# EasyEDA Pro project decimal-up-counter-d-flipflop.epro

# Schematic Schematic1
Board Name: Board1; Create Date: 2025-10-23; Page Name: P1; Project Name: sasindu; Schematic Name: Schematic1; Update Date: 2025-10-23; Company: EasyEDA.com; Page Size: A4; Version: V1.0
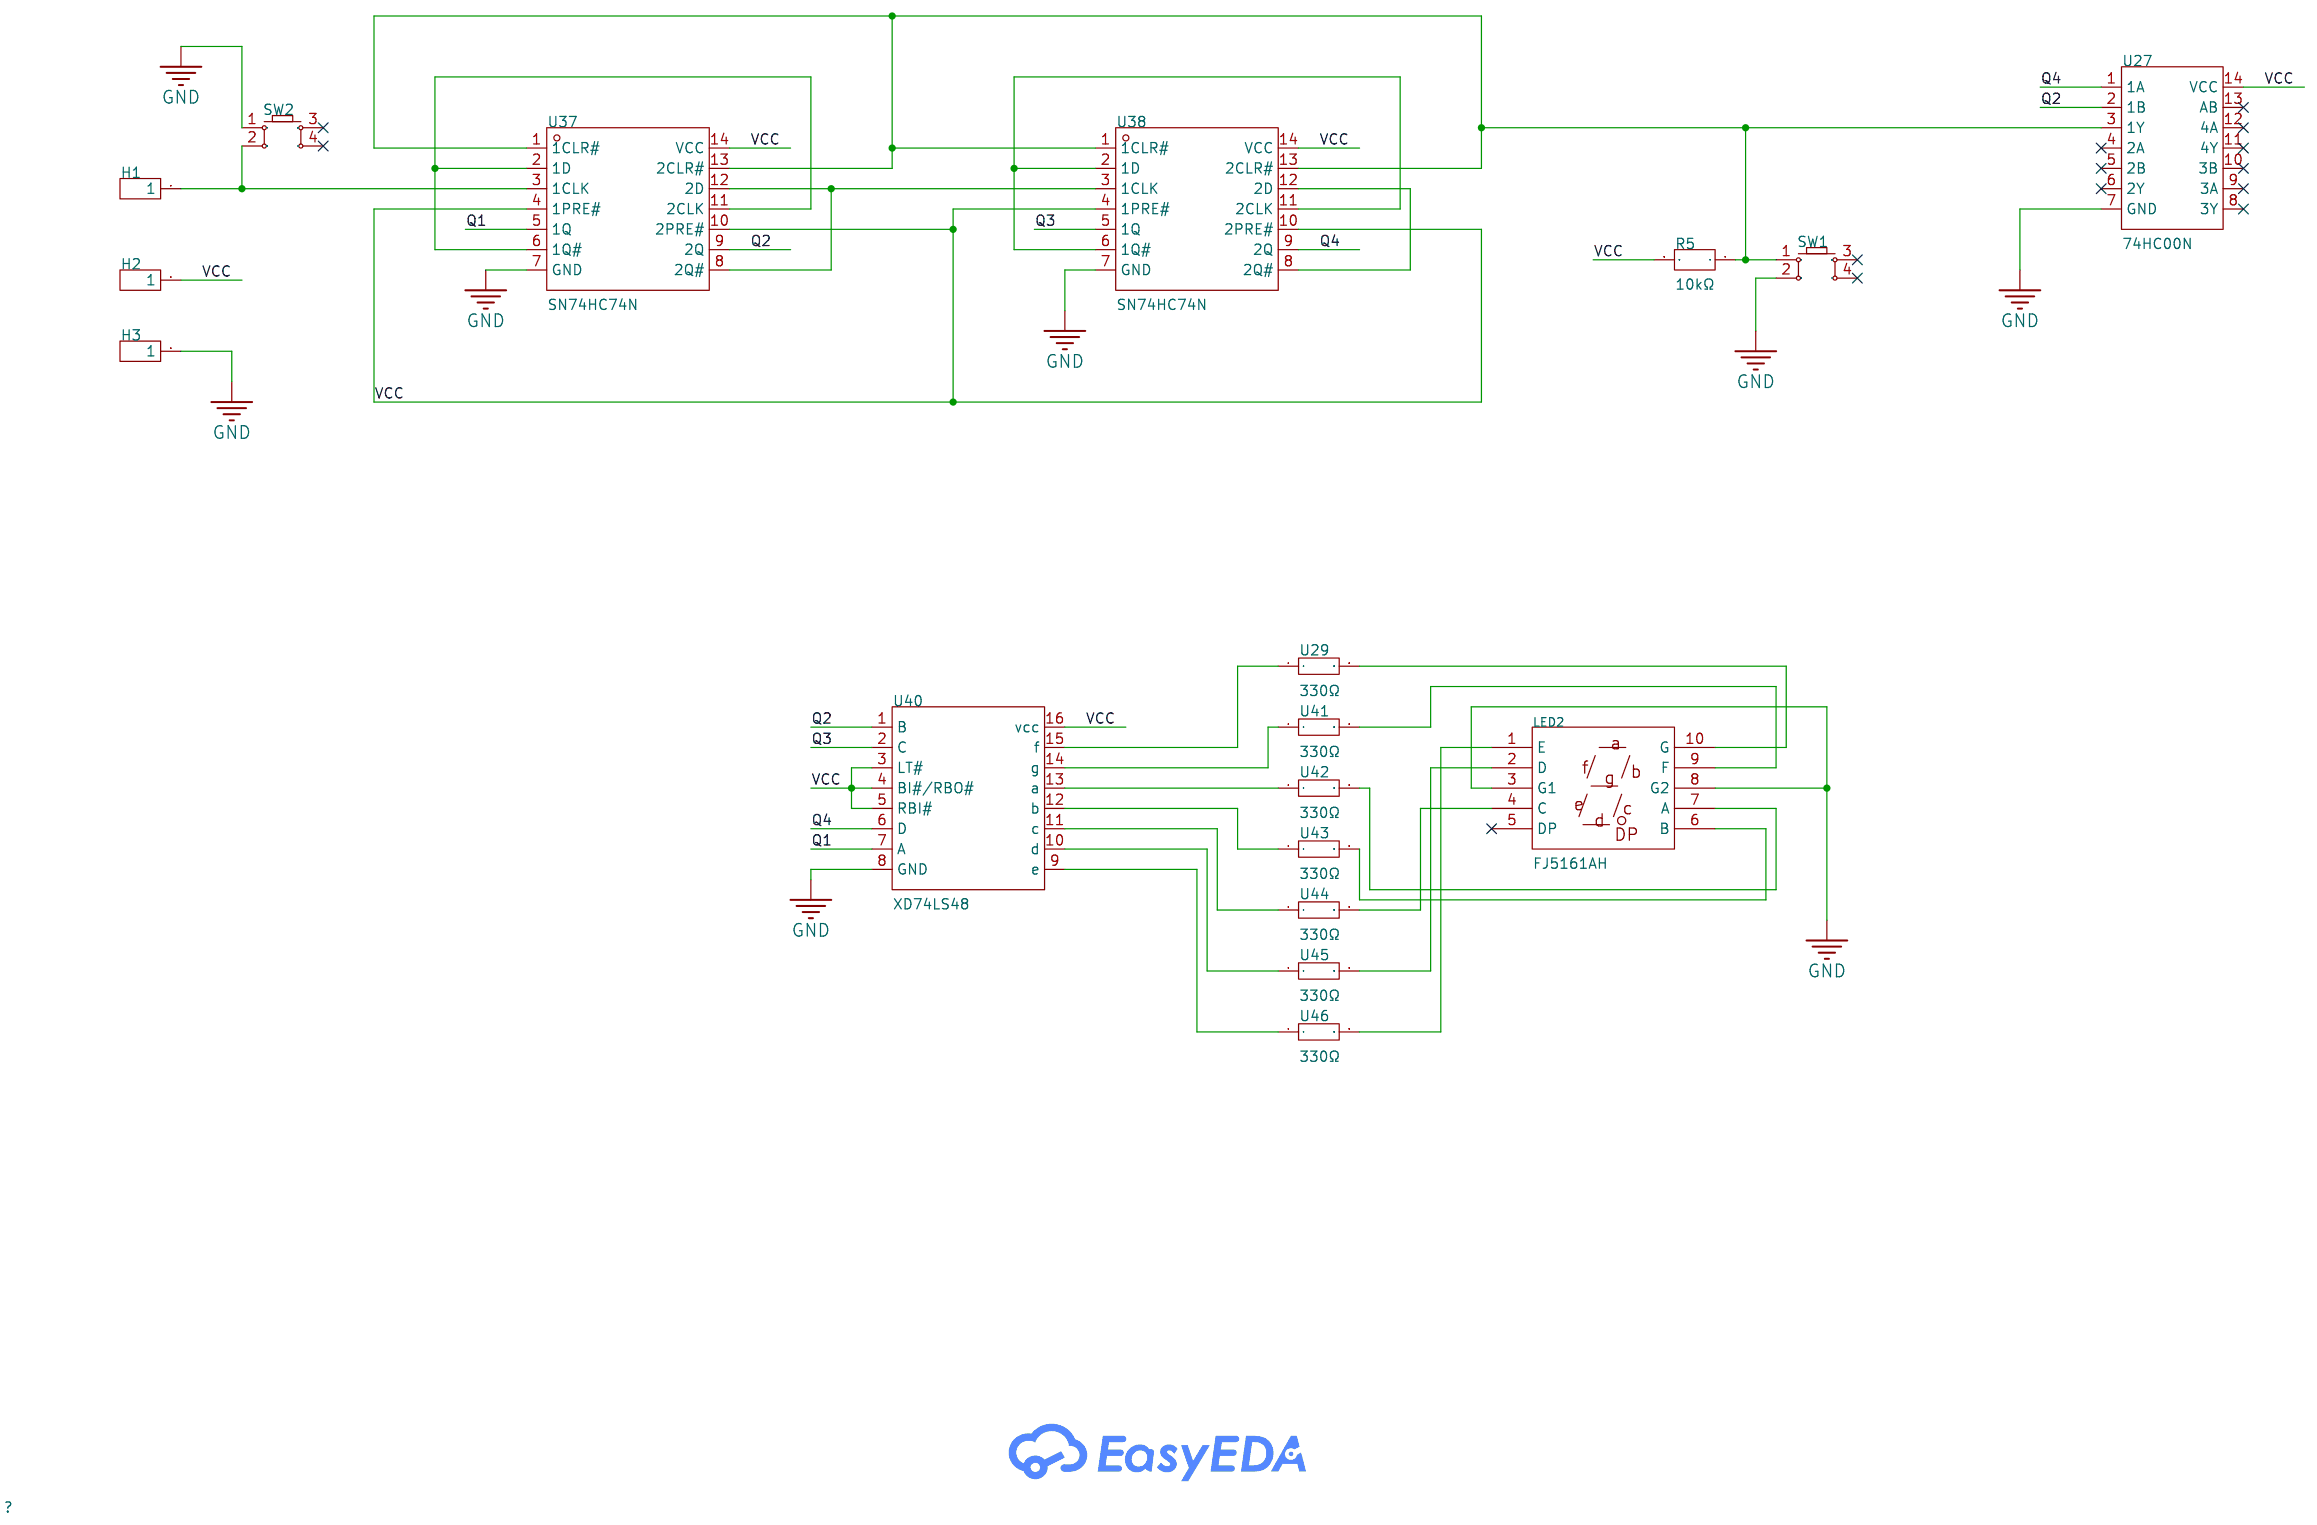
[diagram p0: schematic sheet]

## Parts
H1  -  [HDR-TH_1P-V-M_XKB_X4611WV-01I-C28D40]
H2  -  [HDR-TH_1P-V-M_XKB_X4611WV-01I-C28D40]
H3  -  [HDR-TH_1P-V-M_XKB_X4611WV-01I-C28D40]
LED2  FJ5161AH  [LED-SEG-TH_10P-L12.6-W19.0-P2.54-S15.24-BL]
R5  10kΩ  [RES-TH_BD2.5-L6.5-P10.50-D0.6]
SW1  -  [KEY-TH_4P-L6.0-W6.0-P3.90-LS6.5]
SW2  -  [KEY-TH_4P-L6.0-W6.0-P3.90-LS6.5]
U27  74HC00N  [DIP-14_L19.0-W7.0-P2.54-LS7.6-BL]
U29  330Ω  [RES-TH_BD2.3-L7.1-P11.10-D0.6]
U37  SN74HC74N  [PDIP-14_L19.3-W6.4-P2.54-LS7.6-BL]
U38  SN74HC74N  [PDIP-14_L19.3-W6.4-P2.54-LS7.6-BL]
U40  XD74LS48  [DIP-16_L19.3-W6.4-P2.54-LS7.6-BL]
U41  330Ω  [RES-TH_BD2.3-L7.1-P11.10-D0.6]
U42  330Ω  [RES-TH_BD2.3-L7.1-P11.10-D0.6]
U43  330Ω  [RES-TH_BD2.3-L7.1-P11.10-D0.6]
U44  330Ω  [RES-TH_BD2.3-L7.1-P11.10-D0.6]
U45  330Ω  [RES-TH_BD2.3-L7.1-P11.10-D0.6]
U46  330Ω  [RES-TH_BD2.3-L7.1-P11.10-D0.6]

## Library data of the parts
H1-H3 = HDR-M_2.54_1x1P: Supplier Footprint: Through
LED2 = FJ5161AH: Number of Characters:1 Display Type:- Digit/Alpha Size(inch):0.56 Pd - Power Dissipation:- Illumination Color:Red LED Polarity:Common Cathode; LCSC Part Name: 1位0.56英寸红色数码管 共阴极; Supplier Part: C8093; Manufacturer: 志浩; Supplier Footprint: 插件; JLCPCB Part Class: Extended Part; Datasheet: https://item.szlcsc.com/datasheet/FJ5161AH/8576.html; Supplier: LCSC; Number of Characters: 1; Digit/Alpha Size(inch): 0.56; Illumination Color: Red; LED Polarity: Common Cathode
R5 = MBB02070C1002FCT00: Type:Metal Film Resistors Resistance: Tolerance:±1% Tolerance:±1% Power(Watts):600mW Temperature Coefficient:±50ppm/℃ Temperature Coefficient:±50ppm/℃ Operating Temperature Range:-55℃~+155℃ Operating Temperature Range:-55℃~+155℃; LCSC Part Name: 金属膜电阻 10kΩ ±1% 600mW; Supplier Part: C1364513; Manufacturer: VISHAY(威世); Supplier Footprint: 插件,D2.5xL6.5mm; JLCPCB Part Class: Extended Part; Datasheet: https://atta.szlcsc.com/upload/public/pdf/source/20210430/B7BC0816ABBF03221EE8A99AEEE87AD9.pdf; Supplier: LCSC; Type: Metal Film Resistors; Tolerance: ±1%; Power(Watts): 600mW; Temperature Coefficient: ±50ppm/℃; Operating Temperature Range: -55℃~+155℃
SW1 SW2 = Key_TH_6x6x4.5: Supplier Footprint: Through
U27 = 74HC00N: LCSC Part Name: 停产 74HC00N; Supplier Part: C596352; Manufacturer: HTC; Supplier Footprint: DIP-14; JLCPCB Part Class: Extended Part; Datasheet: https://atta.szlcsc.com/upload/public/pdf/source/20200608/C596352_1E871BDE7F9BA39D848707B6FAD9AD4E.pdf; Supplier: LCSC
U29 U41-U46 = RF25CT52A331J: Type:Fuse Resistor Resistance:330Ω Tolerance:±5% Tolerance:±5% Voltage-Supply(Max):- Operating Temperature:-45℃~+155℃ Operating Temperature:-45℃~+155℃; LCSC Part Name: 保险电阻 330Ω ±5%; Supplier Part: C367444; Manufacturer: KOA; Supplier Footprint: 插件,D2.3xL6.3mm; JLCPCB Part Class: Extended Part; Datasheet: https://atta.szlcsc.com/upload/public/pdf/source/20190124/C367444_F609FD77DA443C76335275F008267365.pdf; Supplier: LCSC; Type: Fuse Resistor; Tolerance: ±5%; Operating Temperature: -45℃~+155℃
U37 U38 = SN74HC74N: Type:D-Type Trigger Type:Rising Edge Voltage - Supply:2V~6V Voltage - Supply:2V~6V Clock Frequency:60MHz Function:Set and Reset Number of Elements:2 Number of Bits per Element:1 Output Type:Complementary Type Propagation Delay:30ns@6V,50pF Series:74HCSeri; Supplier Part: C2895; Manufacturer: TI(德州仪器); Supplier Footprint: DIP-14; JLCPCB Part Class: Extended Part; Datasheet: https://www.ti.com/cn/lit/gpn/sn74hc74; Supplier: LCSC; Type: D-Type; Trigger Type: Rising Edge; Voltage - Supply: 2V~6V; Clock Frequency: 60MHz; Function: Set and Reset; Number of Elements: 2; Number of Bits per Element: 1; Output Type: Complementary Type; Propagation Delay: 30ns@6V,50pF; Series: 74HCSeries; Current - Output Low(IOL): 5.2mA; Current - Output High(IOH): 5.2mA; Quiescent Current: 4uA; Input Capacitance: 3pF; Operating Temperature: -40℃~+85℃
U40 = XD74LS48: Voltage - Supply:4.75V~5.25V Voltage - Supply:4.75V~5.25V Features:Common Cathode Operating Temperature:0℃~+70℃ Operating Temperature:0℃~+70℃; Supplier Part: C609759; Manufacturer: XINLUDA(信路达); Supplier Footprint: DIP-16; JLCPCB Part Class: Extended Part; Datasheet: https://item.szlcsc.com/datasheet/XD74LS48/639764.html; Supplier: LCSC; Voltage - Supply: 4.75V~5.25V; Features: Common Cathode; Operating Temperature: 0℃~+70℃

## Nets
GND: H3.1 LED2.3(G1) LED2.8(G2) SW1.2 SW2.1 U27.7(GND) U37.7(GND) U38.7(GND) U40.8(GND)
VCC: H2.1 R5.2 U27.14(VCC) U37.4(1PRE#) U37.10(2PRE#) U37.14(VCC) U38.4(1PRE#) U38.10(2PRE#) U38.14(VCC) U40.3(LT#) U40.4(BI#/RBO#) U40.5(RBI#) U40.16(vcc)
Q1: U37.5(1Q) U40.7(A)
Q2: U27.2(1B) U37.9(2Q) U40.1(B)
Q3: U38.5(1Q) U40.2(C)
Q4: U27.1(1A) U38.9(2Q) U40.6(D)
$1N245: U38.8(2Q#) U38.12(2D)
$1N262: R5.1 SW1.1 U27.3(1Y) U37.1(1CLR#) U37.13(2CLR#) U38.1(1CLR#) U38.13(2CLR#)
$1N264: U38.2(1D) U38.6(1Q#) U38.11(2CLK)
$1N265: U37.2(1D) U37.6(1Q#) U37.11(2CLK)
$1N266: H1.1 SW2.2 U37.3(1CLK)
$1N268: U37.8(2Q#) U37.12(2D) U38.3(1CLK)
$1N1971: U40.9(e) U46.1
$1N1977: LED2.1(E) U46.2
$1N1984: U40.10(d) U45.1
$1N1990: LED2.2(D) U45.2
$1N2000: U40.11(c) U44.1
$1N2007: LED2.4(C) U44.2
$1N2014: U40.12(b) U43.1
$1N2024: LED2.6(B) U43.2
$1N2040: LED2.7(A) U42.2
$1N2083: LED2.9(F) U41.2
$1N2091: LED2.10(G) U29.2
$1N2112: U29.1 U40.15(f)
$1N2137: U40.14(g) U41.1
$1N2140: U40.13(a) U42.1

Not connected (* = marked no-connect by the designer): LED2 5(DP)*; SW1 3* 4*; SW2 3* 4*; U27 4(2A)* 5(2B)* 6(2Y)* 8(3Y)* 9(3A)* 10(3B)* 11(4Y)* 12(4A)* 13(AB)*

# Board PCB1
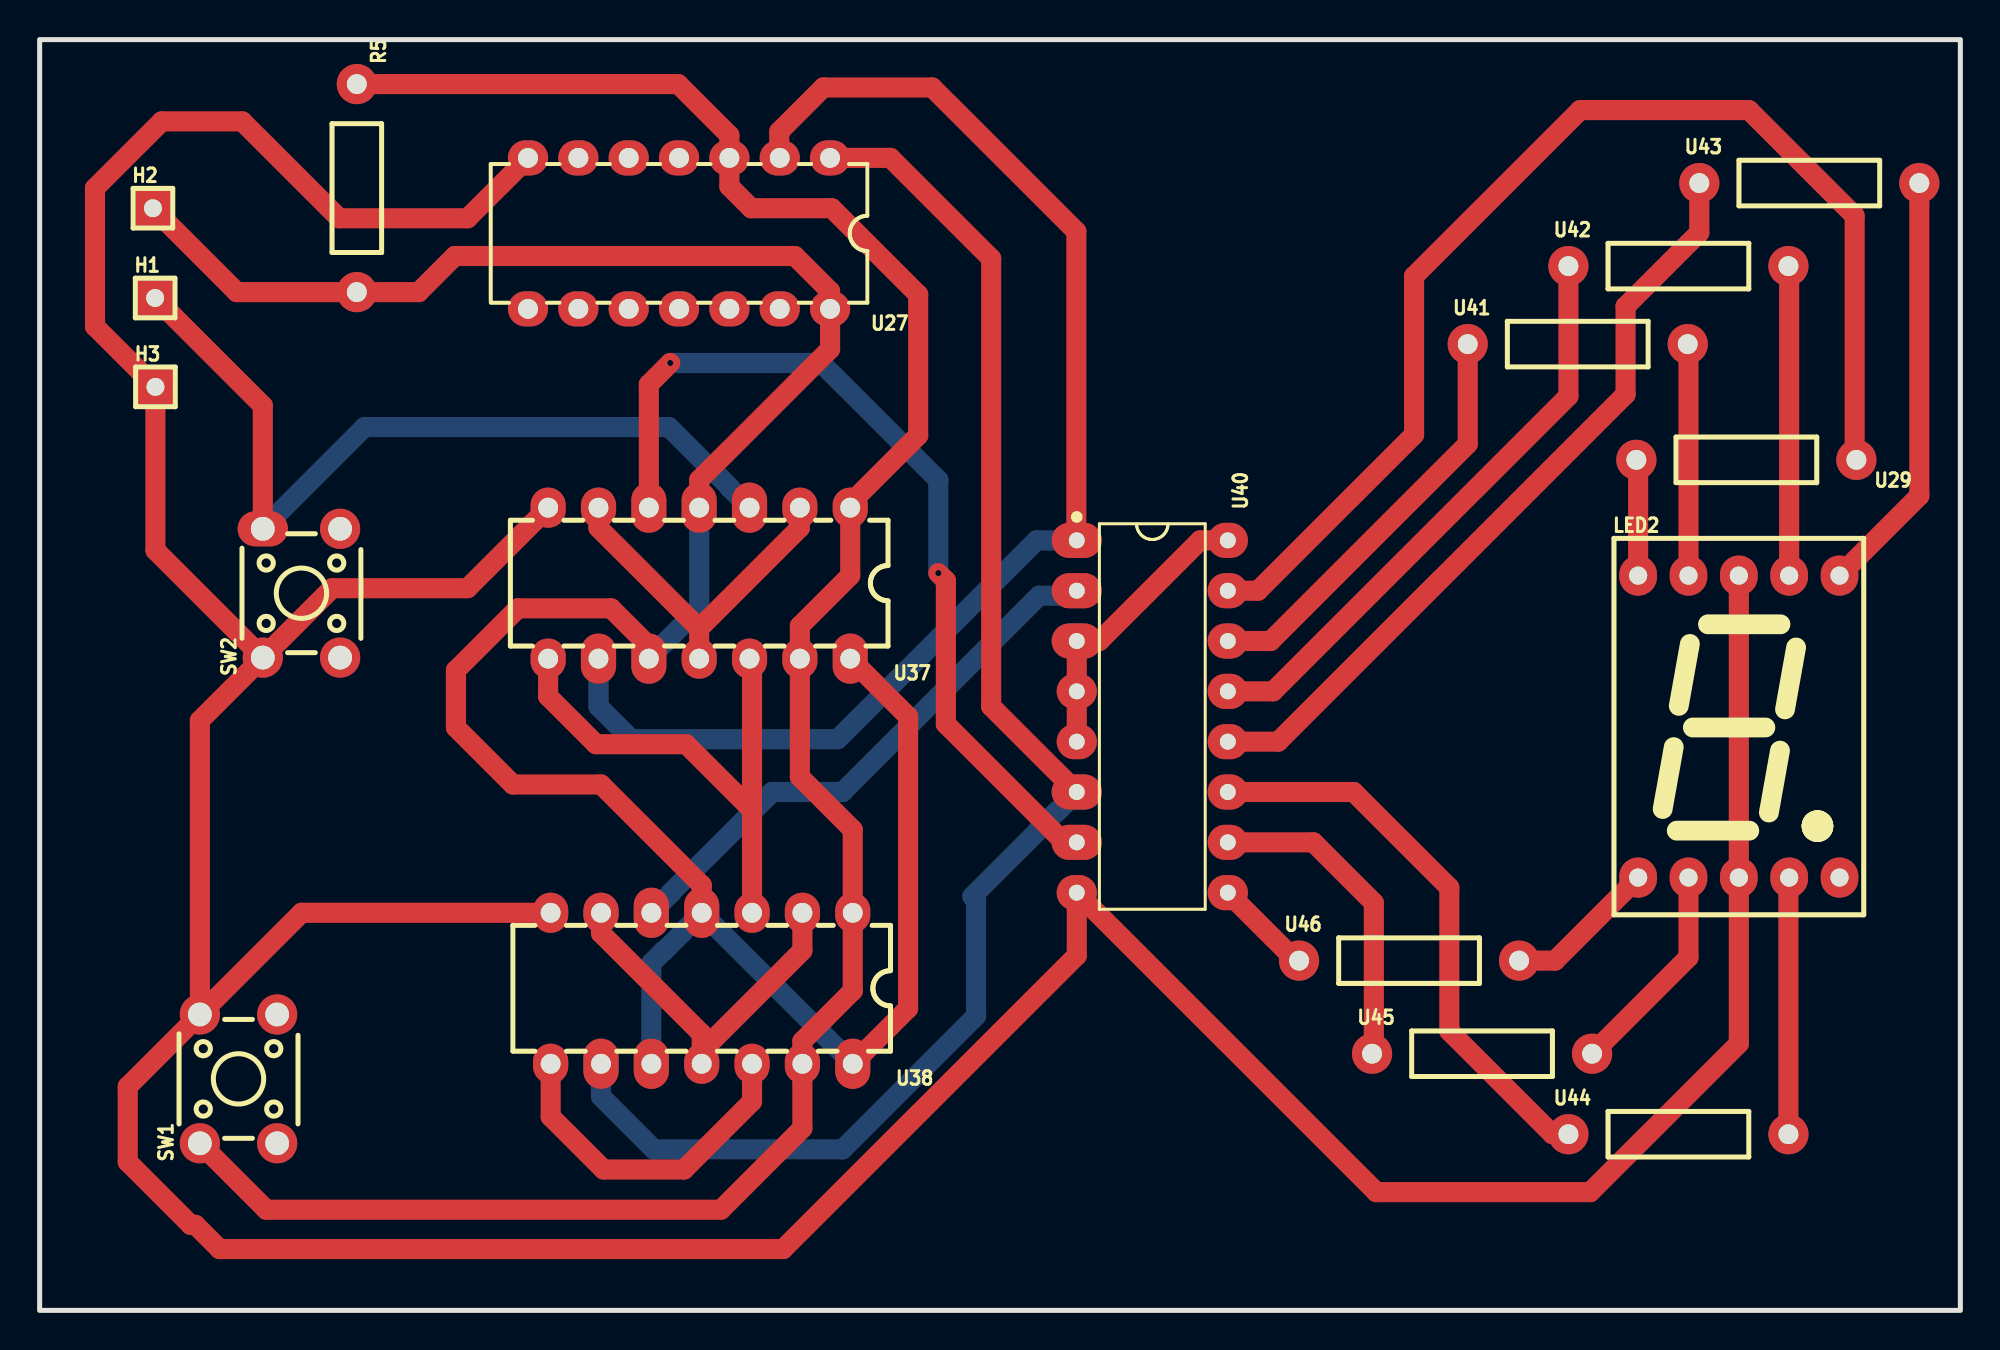
[diagram p1: board, top side]
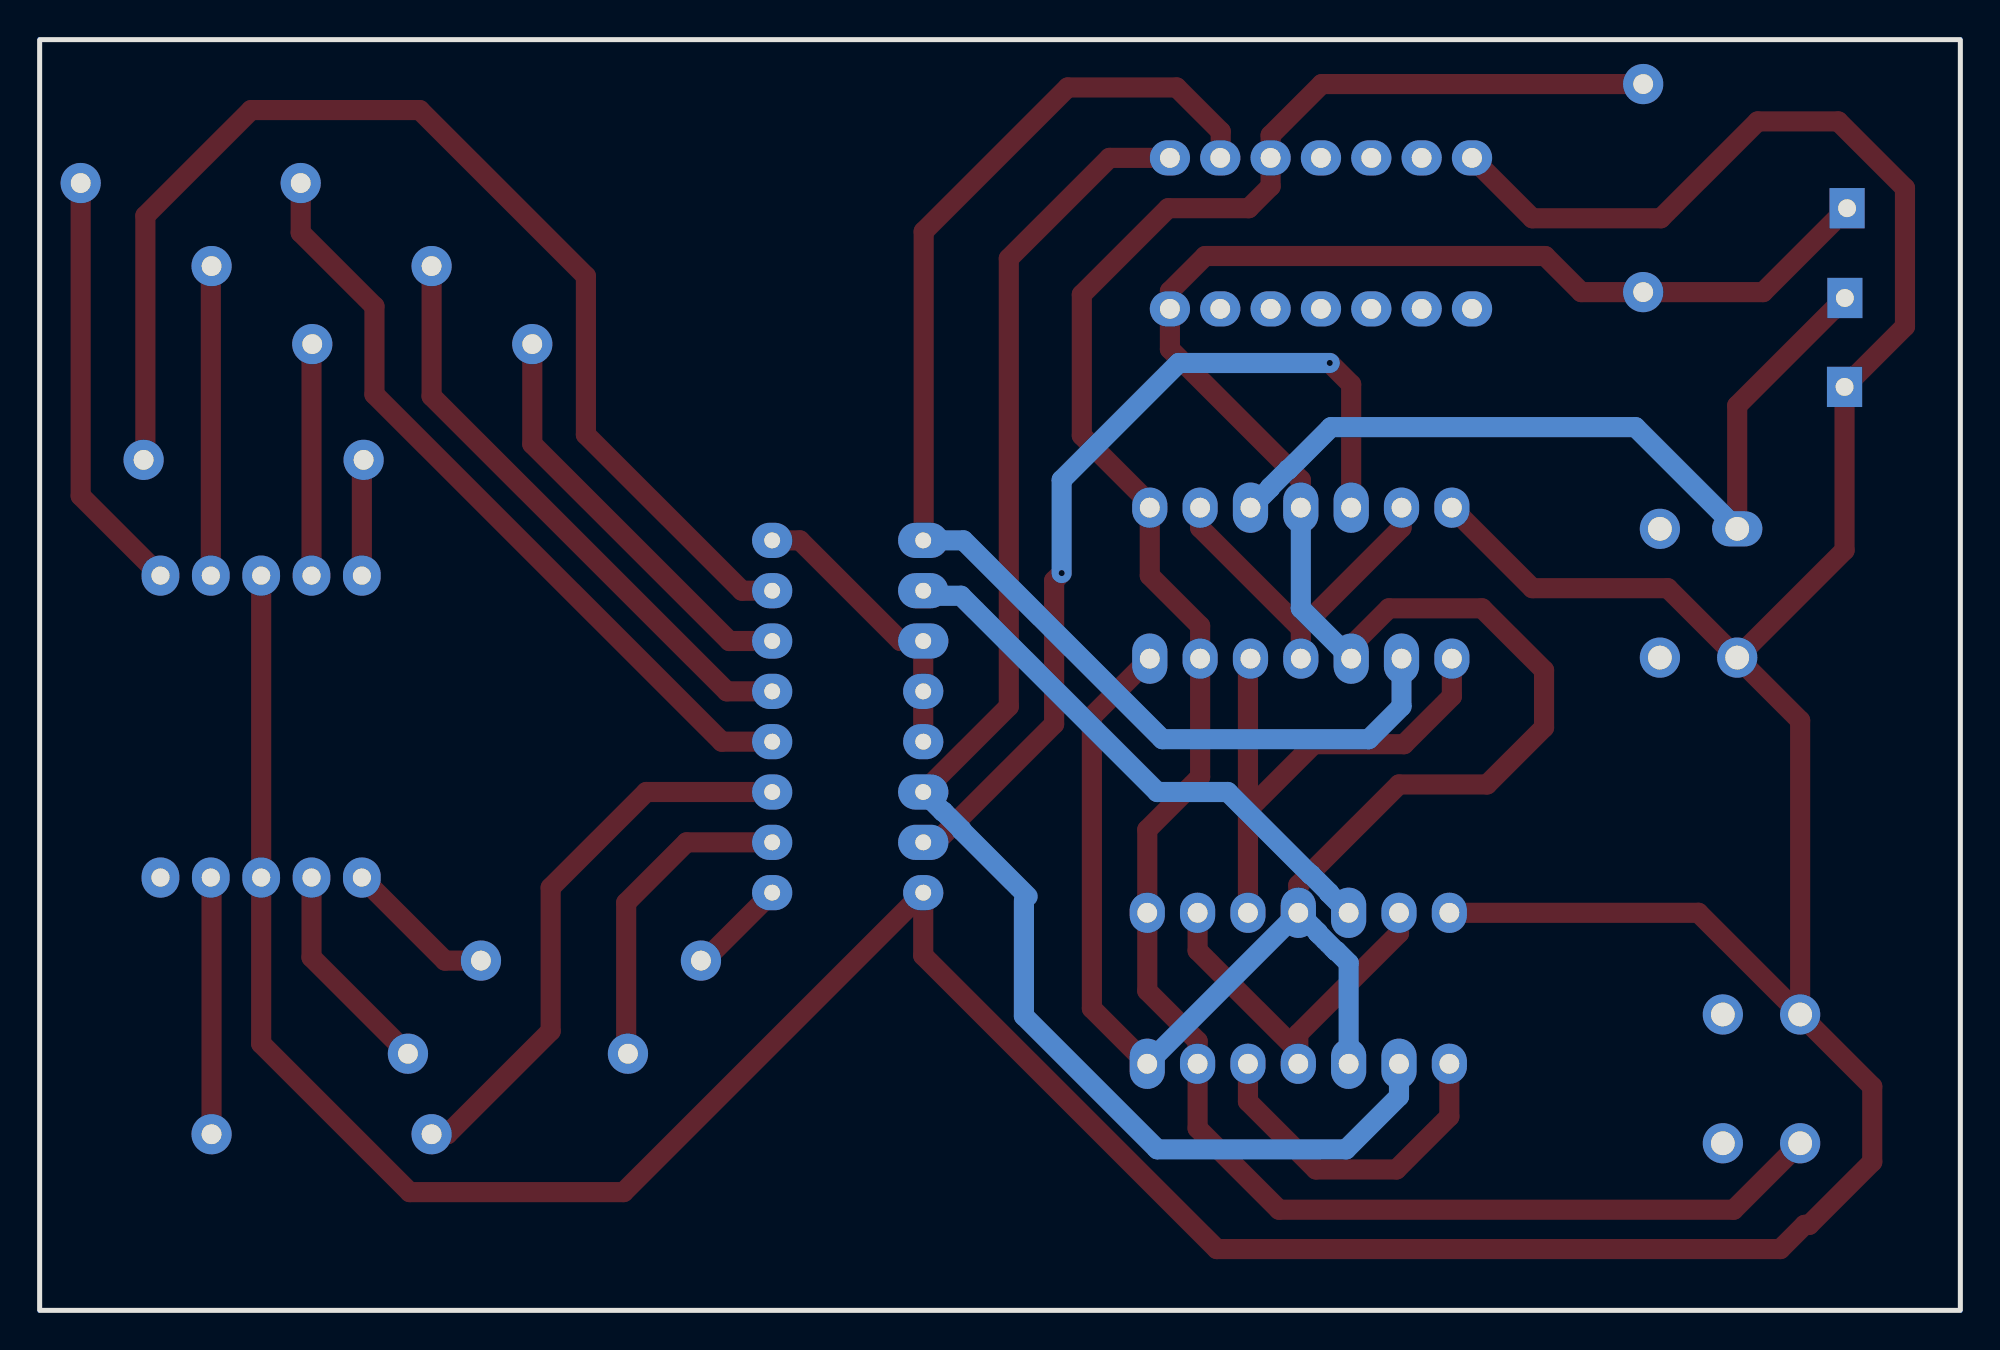
[diagram p2: board, bottom side, seen from below]

Outline 96.9 x 64.13 mm; copper layers: Top Layer, Bottom Layer. Coordinates in mm from the lower left corner of the outline.
Outline path: rectangle 0,64.13 96.9,0
Stack: Top Layer 0.035mm / Dielectric1 1.51mm FR4 er 4.5 / Bottom Layer 0.035mm

## Design rules (mm)
template: JLCPCB Capability(Two Layers Board)
spacing copperThickness1oz (default): track to track 0.102, other pairs 0.152 to 0.3
spacing copperThickness2oz: track to track 0.203, other pairs 0.152 to 0.3
track width copperThickness1oz (default): min 0.127, default 0.254, max 2.54
track width copperThickness2oz: min 0.203, default 0.254, max 2.54
differential pair differentialPair (default): width min 0.127, default 0.254, max 2.54; gap min 0.152, default 0.152
via viaSize (default): diameter min 0.5, default 0.61, max 10; hole min 0.3, default 0.305, max 6.3

## Placement (name value [footprint] x y rotation side)
H1  -  [HDR-TH_1P-V-M_XKB_X4611WV-01I-C28D40]  5.83 51.09 0 top
H2  -  [HDR-TH_1P-V-M_XKB_X4611WV-01I-C28D40]  5.71 55.63 0 top
H3  -  [HDR-TH_1P-V-M_XKB_X4611WV-01I-C28D40]  5.84 46.61 0 top
LED2  FJ5161AH  [LED-SEG-TH_10P-L12.6-W19.0-P2.54-S15.24-BL]  85.72 29.46 0 top
R5  10kΩ  [RES-TH_BD2.5-L6.5-P10.50-D0.6]  16 56.64 270 top
SW1  -  [KEY-TH_4P-L6.0-W6.0-P3.90-LS6.5]  10.03 11.68 90 top
SW2  -  [KEY-TH_4P-L6.0-W6.0-P3.90-LS6.5#2]  13.21 36.19 90 top
U27  74HC00N  [DIP-14_L19.0-W7.0-P2.54-LS7.6-BL]  32.26 54.36 180 top
U29  330Ω  [RES-TH_BD2.3-L7.1-P11.10-D0.6]  86.11 42.93 180 top
U37  SN74HC74N  [PDIP-14_L19.3-W6.4-P2.54-LS7.6-BL#2]  33.27 36.7 180 top
U38  SN74HC74N  [PDIP-14_L19.3-W6.4-P2.54-LS7.6-BL]  33.4 16.26 180 top
U40  XD74LS48  [DIP-16_L19.3-W6.4-P2.54-LS7.6-BL]  56.13 29.97 270 top
U41  330Ω  [RES-TH_BD2.3-L7.1-P11.10-D0.6]  77.6 48.77 0 top
U42  330Ω  [RES-TH_BD2.3-L7.1-P11.10-D0.6]  82.68 52.7 0 top
U43  330Ω  [RES-TH_BD2.3-L7.1-P11.10-D0.6]  89.28 56.9 0 top
U44  330Ω  [RES-TH_BD2.3-L7.1-P11.10-D0.6]  82.68 8.89 0 top
U45  330Ω  [RES-TH_BD2.3-L7.1-P11.10-D0.6]  72.77 12.95 0 top
U46  330Ω  [RES-TH_BD2.3-L7.1-P11.10-D0.6]  69.09 17.65 0 top

## Footprints (pads in the part's own frame, mm; a bottom-side part is the same pattern mirrored in y, then rotated)
DIP-14_L19.0-W7.0-P2.54-LS7.6-BL
  oval 2.032x1.778 hole 1: 1(-7.62,-3.81) 2(-5.08,-3.81) 3(-2.54,-3.81) 4(0,-3.81) 5(2.54,-3.81) 6(5.08,-3.81) 7(7.62,-3.81) 8(7.62,3.81) 9(5.08,3.81) 10(2.54,3.81) 11(0,3.81) 12(-2.54,3.81) 13(-5.08,3.81) 14(-7.62,3.81)
DIP-16_L19.3-W6.4-P2.54-LS7.6-BL
  oval 1.778x2.54 hole 0.8: 1(-8.89,-3.81) 2(-6.35,-3.81) 3(-3.81,-3.81) 6(3.81,-3.81) 7(6.35,-3.81)
  oval 1.778x2.032 hole 0.8: 4(-1.27,-3.81) 5(1.27,-3.81) 8(8.89,-3.81) 9(8.89,3.81) 10(6.35,3.81) 11(3.81,3.81) 12(1.27,3.81) 13(-1.27,3.81) 14(-3.81,3.81) 15(-6.35,3.81) 16(-8.89,3.81)
HDR-TH_1P-V-M_XKB_X4611WV-01I-C28D40
  rect 1.778x2.032 hole 0.9: 1(0,0)
KEY-TH_4P-L6.0-W6.0-P3.90-LS6.5
  round 2.032 hole 1.2: 1(-3.25,1.95) 2(3.25,1.95) 3(-3.25,-1.95) 4(3.25,-1.95)
KEY-TH_4P-L6.0-W6.0-P3.90-LS6.5#2
  round 2.032 hole 1.2: 1(-3.25,1.95) 3(-3.25,-1.95) 4(3.25,-1.95)
  oval 1.778x2.54 hole 1.2: 2(3.25,1.95)
LED-SEG-TH_10P-L12.6-W19.0-P2.54-S15.24-BL
  oval 1.905x2.032 hole 0.914: 1(-5.08,-7.62) 2(-2.54,-7.62) 3(0,-7.62) 4(2.54,-7.62) 5(5.08,-7.62) 6(5.08,7.62) 7(2.54,7.62) 8(0,7.62) 9(-2.54,7.62) 10(-5.08,7.62)
PDIP-14_L19.3-W6.4-P2.54-LS7.6-BL
  oval 1.778x2.032 hole 1: 1(-7.62,-3.81) 2(-5.08,-3.81) 3(-2.54,-3.81) 6(5.08,-3.81) 7(7.62,-3.81) 8(7.62,3.81) 11(0,3.81) 12(-2.54,3.81) 13(-5.08,3.81)
  oval 1.778x2.54 hole 1: 4(0,-3.81) 5(2.54,-3.81) 9(5.08,3.81) 10(2.54,3.81) 14(-7.62,3.81)
PDIP-14_L19.3-W6.4-P2.54-LS7.6-BL#2
  oval 1.778x2.032 hole 1: 1(-7.62,-3.81) 2(-5.08,-3.81) 6(5.08,-3.81) 7(7.62,-3.81) 8(7.62,3.81) 11(0,3.81) 12(-2.54,3.81) 13(-5.08,3.81)
  oval 1.778x2.54 hole 1: 3(-2.54,-3.81) 4(0,-3.81) 5(2.54,-3.81) 9(5.08,3.81) 10(2.54,3.81) 14(-7.62,3.81)
RES-TH_BD2.3-L7.1-P11.10-D0.6
  round 2.032 hole 1: 1(-5.55,0) 2(5.55,0)
RES-TH_BD2.5-L6.5-P10.50-D0.6
  round 2.032 hole 1: 1(-5.25,0) 2(5.25,0)

## Nets
As in the schematic.

Pads without a net: LED2 5; SW1 3 4; SW2 3 4; U27 4 5 6 8 9 10 11 12 13

## Via types
v1: diameter 0.61, hole 0.305, Top Layer to Bottom Layer, 2 vias

## Routing (per net, layer and track width the routed paths; a pad name or vN(x,y) marks a point on that pad's centre or on a via; arc(x,y) is an arc through that point)
GND: length 244.8
  Top Layer w1.016: SW1.2 8.08,29.77 SW2.1 ; SW1.2 13.21,20.07 U38.7 ; SW1.2 4.44,11.3 4.44,7.49 7.62,4.32 7.86,4.32 9.08,3.09 37.51,3.09 52.32,17.91 U40.8 67.44,5.97 78.23,5.97 85.72,13.46 LED2.3 85.72,37.08 ; SW2.1 14.76,36.45 21.59,36.45 U37.7 ; SW2.1 5.84,38.36 H3.1 2.79,49.66 2.79,56.64 6.16,60.01 10.22,60.01 15.11,55.12 21.59,55.12 24.64,58.17
VCC: length 148.9
  Top Layer w1.016: U40.5 U40.4 U40.3 53.47,33.78 58.55,38.86 U40.16 ; U38.4 33.4,21.46 28.32,26.54 23.88,26.54 21,29.42 21,32.31 24.13,35.43 28.83,35.43 30.73,33.53 U37.10 ; 41.02,12.45 43.81,15.24 43.81,29.97 U37.14 ; U37.4 33.27,41.91 39.88,48.51 39.88,51.43 38.1,53.21 20.95,53.21 19.13,51.39 R5.2 9.95,51.39 H2.1
  Bottom Layer w1.016: U38.4 32.41,19.07 32.41,19.04 31.5,18.14 31.47,18.14 30.86,17.53 30.86,12.45 ; 41.02,12.45 33.91,19.56 33.53,19.56 ; U37.10 33.27,35.43 U37.4
Q1: length 45.3
  Top Layer w1.016: v1(45.34,37.21) 45.72,36.83 45.72,29.59 51.69,23.62 U40.7 ; U37.5 30.73,46.74 v1(31.81,47.82)
  Bottom Layer w1.016: v1(45.34,37.21) 45.34,41.91 39.43,47.82 v1(31.81,47.82)
Q2: length 67.2
  Top Layer w1.016: U40.1 52.3,38.88 52.3,54.45 45.03,61.72 39.54,61.72 37.32,59.5 37.32,58.19 37.34,58.17
  Bottom Layer w1.016: U37.9 28.19,30.48 29.84,28.83 40.26,28.83 50.29,38.86 U40.1
Q3: length 28.2
  Bottom Layer w1.016: U38.5 31.85,21.06 31.85,21.09 32.76,22 32.79,22 36.96,26.16 40.51,26.16 50.42,36.07 52.07,36.07 U40.2
Q4: length 76.7
  Top Layer w1.016: 39.88,58.17 42.93,58.17 48.01,53.09 48.01,30.48 U40.6
  Bottom Layer w1.016: 47.24,20.7 47.24,14.86 40.51,8.13 30.99,8.13 28.32,10.79 28.32,12.45 ; U40.6 51.33,25.17 51.3,25.17 50.39,24.26 50.39,24.23 47.05,20.89
$1N245: length 17.3
  Top Layer w1.016: 25.78,12.45 25.78,9.78 28.45,7.11 32.51,7.11 35.94,10.54 35.94,12.45
$1N262: length 114.4
  Top Layer w1.016: R5.1 32.22,61.89 34.8,59.31 U27.3 34.8,56.73 35.9,55.63 39.97,55.63 44.32,51.27 44.32,44.16 40.89,40.73 U37.1 40.89,37.08 38.35,34.54 38.35,26.92 41.02,24.26 U38.1 41.02,16.13 38.48,13.59 38.48,9.19 34.37,5.08 11.44,5.08 SW1.1
$1N264: length 18.8
  Top Layer w1.016: 33.4,13.08 33.4,13.96 28.32,19.04 U38.6 ; 33.4,13.08 33.4,12.45 ; 33.4,13.08 38.48,18.16 U38.2
$1N265: length 17.9
  Top Layer w1.016: 38.35,40.51 38.35,39.5 33.27,34.42 ; U37.11 33.27,34.42 ; 33.27,34.42 28.19,39.5 U37.6
$1N266: length 42.3
  Top Layer w1.016: SW2.2 11.26,45.66 H1.1
  Bottom Layer w1.016: SW2.2 16.39,44.58 31.75,44.58 33.88,42.44 33.92,42.44 34.82,41.54 34.82,41.5 U37.3
$1N268: length 27.4
  Top Layer w1.016: U37.12 35.94,32.77 35.94,25.25 ; 35.94,25.25 32.62,28.57 28.07,28.57 25.65,30.99 U37.8 ; 35.94,25.25 U38.3
$1N1971: length 5
  Top Layer w1.016: U46.1 63.37,17.65 U40.9
$1N1977: length 7.7
  Top Layer w1.016: LED2.1 76.45,17.65 U46.2
$1N1984: length 16.3
  Top Layer w1.016: U45.1 67.31,13.04 67.31,20.57 64.26,23.62 U40.10
$1N1990: length 10.9
  Top Layer w1.016: U45.2 83.19,17.82 LED2.2
$1N2000: length 28.6
  Top Layer w1.016: U40.11 66.29,26.16 71.12,21.34 71.12,14.1 76.33,8.89 U44.1
$1N2007: length 13
  Top Layer w1.016: U44.2 88.23,21.81 LED2.4
$1N2014: length 39.5
  Top Layer w1.016: U40.12 62.48,28.7 80.01,46.23 80.01,50.67 83.73,54.39 U43.1
$1N2024: length 21.5
  Top Layer w1.016: 90.81,37.08 94.83,41.11 U43.2
$1N2040: length 15.6
  Top Layer w1.016: U42.2 88.26,52.67 88.26,37.08
$1N2083: length 11.8
  Top Layer w1.016: 83.19,37.08 83.19,48.48 82.89,48.77
$1N2091: length 5.9
  Top Layer w1.016: U29.2 80.64,42.84 80.64,37.08
$1N2112: length 60.9
  Top Layer w1.016: U40.15 61.47,36.32 69.34,44.2 69.34,52.2 77.72,60.58 86.23,60.58 91.57,55.24 91.57,43.01 U29.1
$1N2137: length 21.3
  Top Layer w1.016: U40.14 62.1,33.78 72.05,43.73 U41.1
$1N2140: length 29.9
  Top Layer w1.016: U40.13 62.23,31.24 77.13,46.14 U42.1
